# EAGLE schematic TSOC_NEOLED_R0_2 (EAGLE 6.6.0)
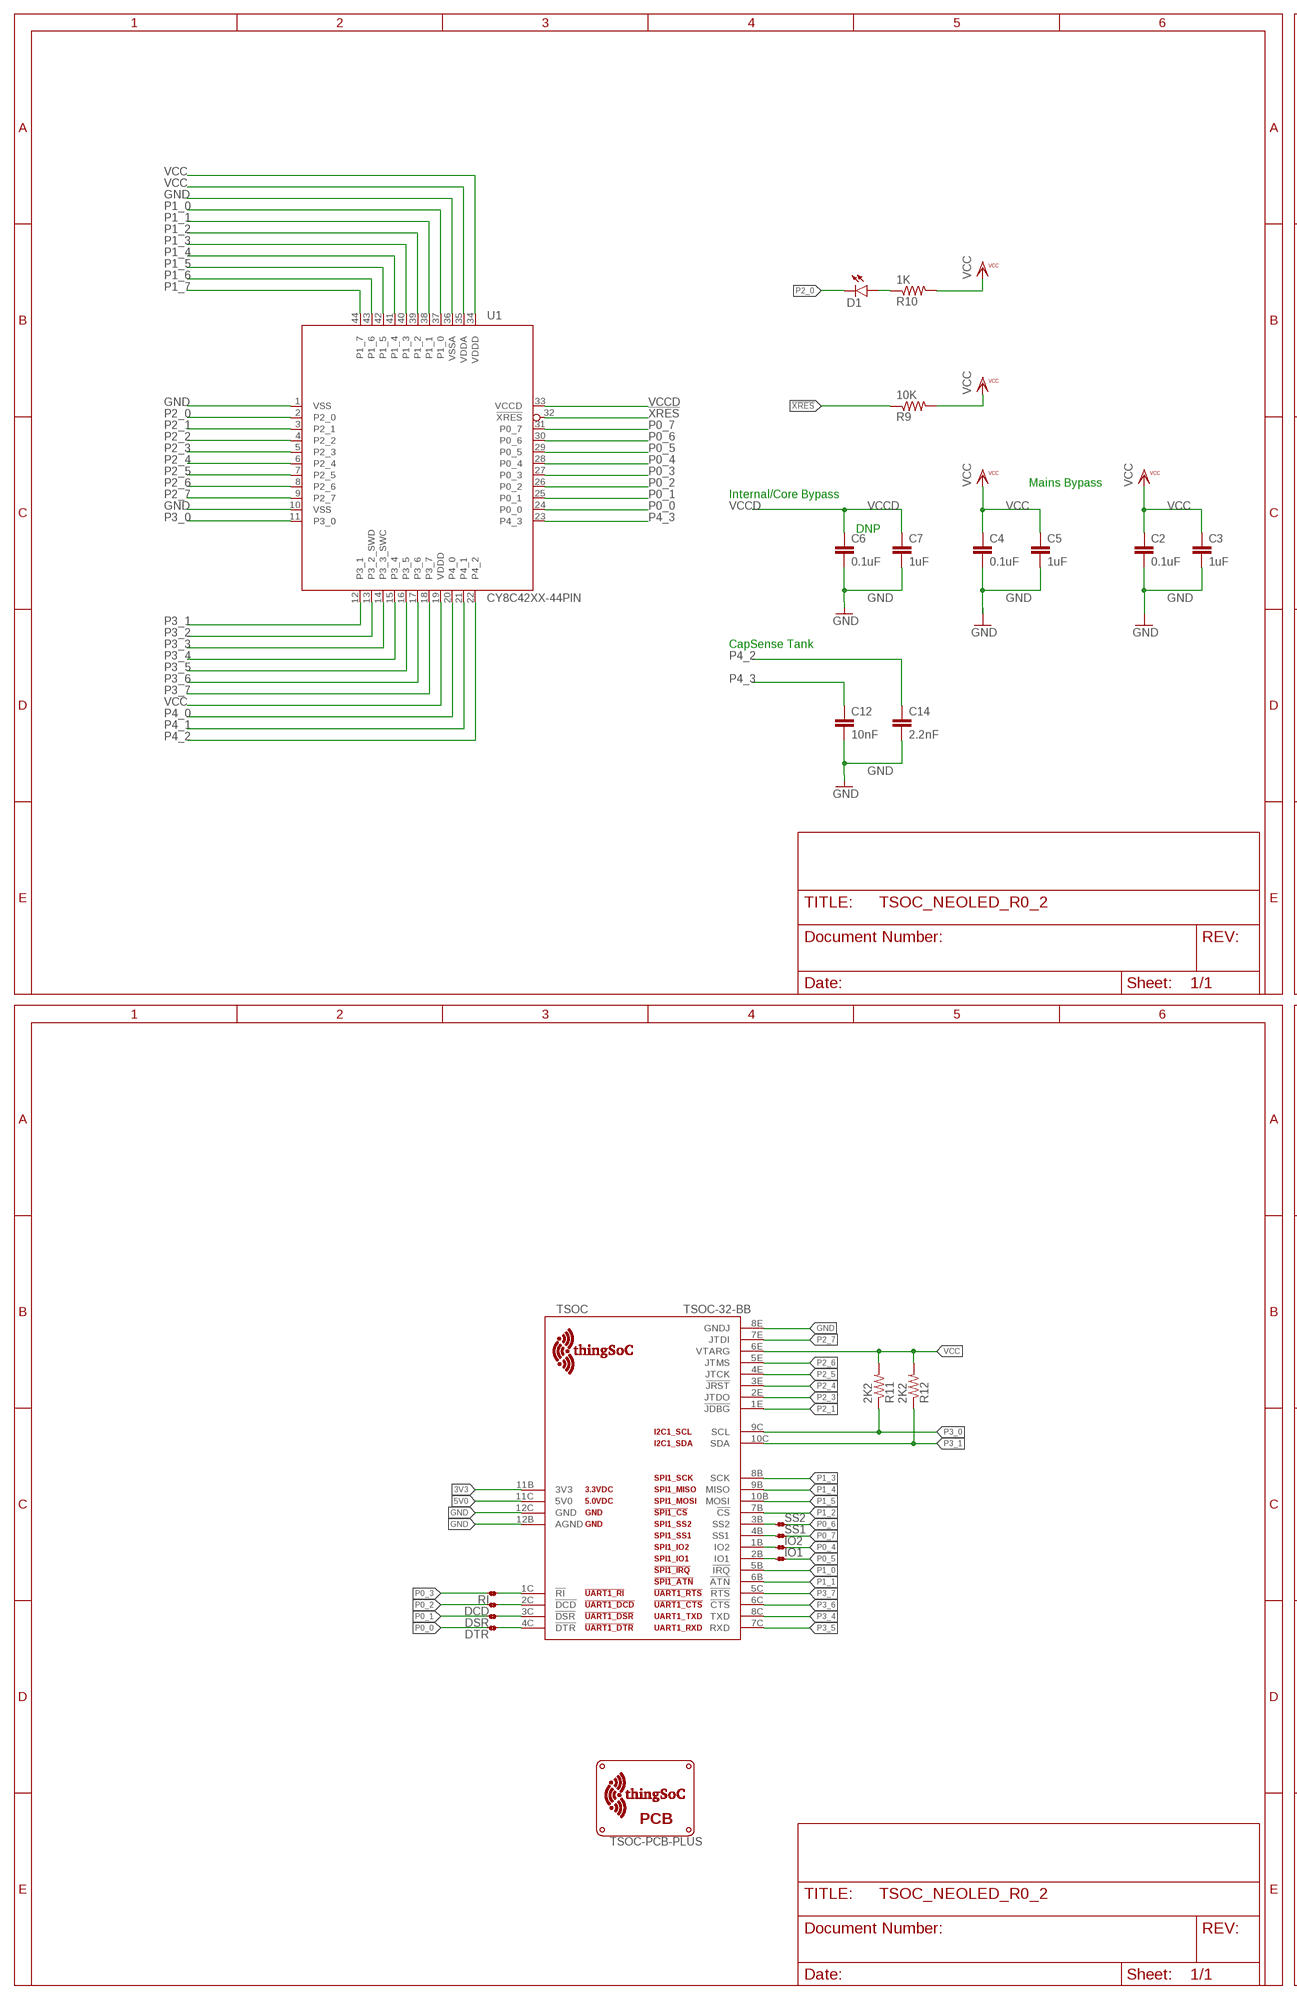
[diagram p0: schematic, sheet 1, part 1 of 2]
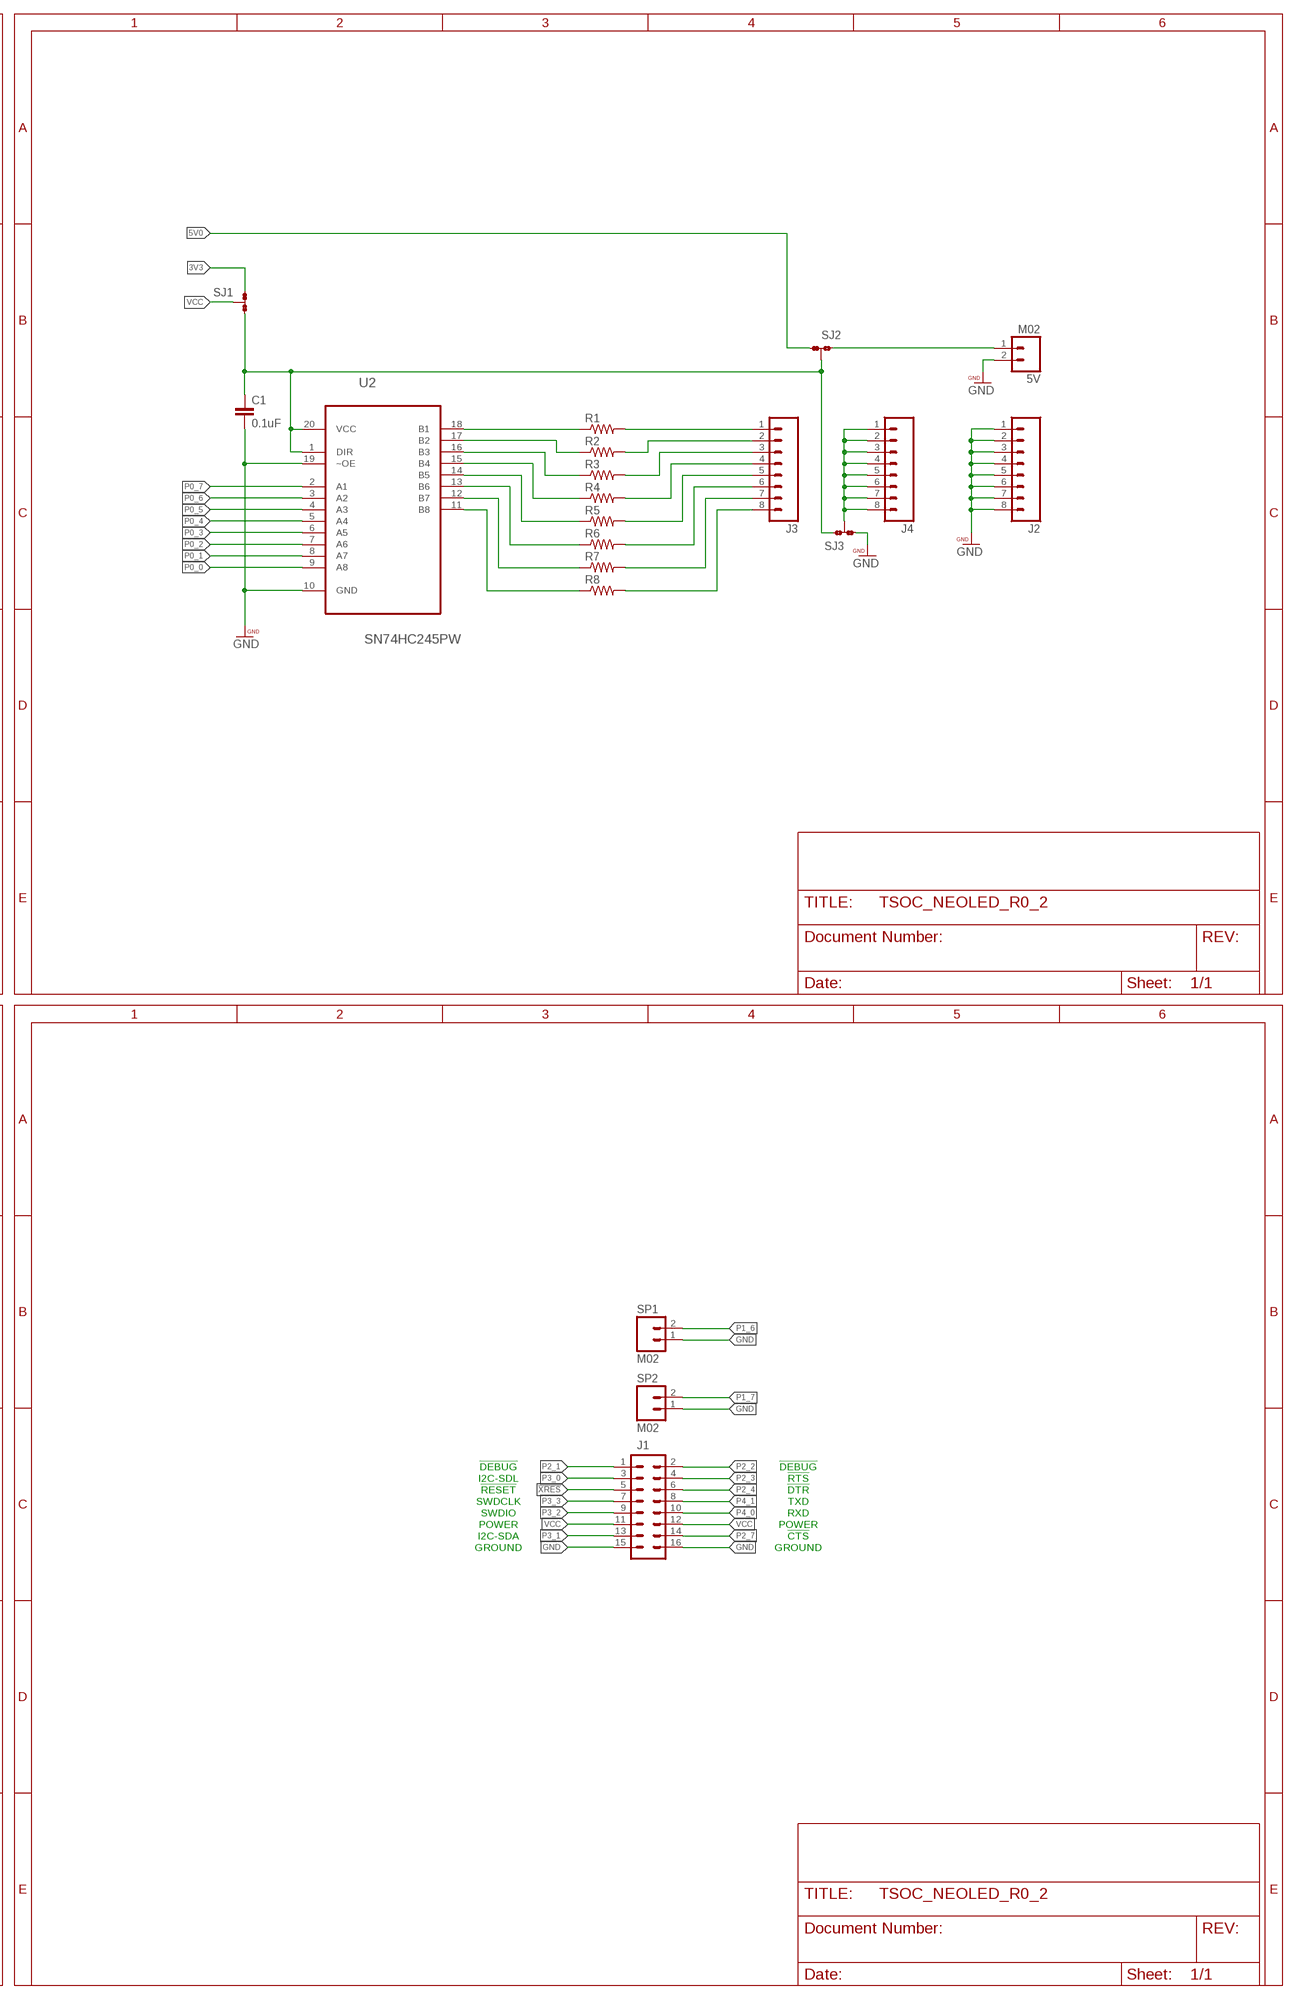
[diagram p1: schematic, sheet 1, part 2 of 2]

## Parts
5V  M02  [1X02]
C1  0.1uF  CAP0603-CAP  [0603-CAP]
C2  0.1uF  CAP0603-CAP  [0603-CAP]
C3  1uF  CAP0603-CAP  [0603-CAP]
C4  0.1uF  CAP0603-CAP  [0603-CAP]
C5  1uF  CAP0603-CAP  [0603-CAP]
C6  0.1uF  CAP0603-CAP  [0603-CAP]
C7  1uF  CAP0603-CAP  [0603-CAP]
C12  10nF  CAP0603-CAP  [0603-CAP]
C14  2.2nF  CAP0603-CAP  [0603-CAP]
D1  LED0603  [LED-0603]
DCD  JMP-2-NO  [JMP-2-NO]
DSR  JMP-2-NO  [JMP-2-NO]
DTR  JMP-2-NO  [JMP-2-NO]
IO1  JMP-2-NO  [JMP-2-NO]
IO2  JMP-2-NO  [JMP-2-NO]
J1  M08X2  [2X8]
J2  M08  [1X08_ROUND]
J3  M08  [1X08_ROUND]
J4  M08  [1X08_ROUND]
R1  RESISTOR0603-RES  [0603-RES]
R2  RESISTOR0603-RES  [0603-RES]
R3  RESISTOR0603-RES  [0603-RES]
R4  RESISTOR0603-RES  [0603-RES]
R5  RESISTOR0603-RES  [0603-RES]
R6  RESISTOR0603-RES  [0603-RES]
R7  RESISTOR0603-RES  [0603-RES]
R8  RESISTOR0603-RES  [0603-RES]
R9  10K  RESISTOR_SFE0603-RES  [0603-RES]
R10  1K  RESISTOR_SFE0603-RES  [0603-RES]
R11  2K2  RESISTOR_SFE0603-RES  [0603-RES]
R12  2K2  RESISTOR_SFE0603-RES  [0603-RES]
RI  JMP-2-NO  [JMP-2-NO]
SJ1  JMP-3-1_2  [JMP-3-1_2]
SJ2  JMP-3-1_2  [JMP-3-1_2]
SJ3  JMP-3-1_2  [JMP-3-1_2]
SP1  M02  [1X02]
SP2  M02  [1X02]
SS1  JMP-2-NO  [JMP-2-NO]
SS2  JMP-2-NO  [JMP-2-NO]
TSOC  TSOC-32-BB  [TSOC-BB-S32]
U1  CY8C42XX-44PIN  [TQFP-10X10-44]
U2  SN74HC245PW  [SOP65P640X120-20N]
U$3  TSOC-PCB-PLUS  [TSOC-BB-BRD-PLUS]

## Nets
3V3: SJ1.1 TSOC.11B(3V3)
5V0: SJ2.1 TSOC.11C(5V0)
!DCD: DCD.1 TSOC.2C(!DCD)
!DSR: DSR.1 TSOC.3C(!DSR)
!DTR: DTR.1 TSOC.4C(!DTR)
!R!: RI.1 TSOC.1C(!RI)
!XRES: J1.5 R9.1 U1.32(!XRES)
GND: 5V.2 C1.2 C2.2 C3.2 C4.2 C5.2 C6.2 C7.2 C12.2 C14.2 J1.15 J1.16 J2.1 J2.2 J2.3 J2.4 J2.5 J2.6 J2.7 J2.8 SJ3.1 SP1.1 SP2.1 TSOC.8E(GNDJ) TSOC.12B(AGND) TSOC.12C(GND) U1.1(VSS) U1.10(VSS) U1.36(VSSA) U2.10(GND) U2.19(~OE)
IO1: IO1.1 TSOC.2B(IO1)
IO2: IO2.1 TSOC.1B(IO2)
N$1: J3.1 R1.2
N$2: J3.2 R2.2
N$3: J3.3 R3.2
N$4: J3.4 R4.2
N$5: J3.5 R5.2
N$6: J3.6 R6.2
N$7: J3.7 R7.2
N$8: J3.8 R8.2
N$9: R1.1 U2.18(B1)
N$10: R2.1 U2.17(B2)
N$11: R3.1 U2.16(B3)
N$12: R4.1 U2.15(B4)
N$13: R5.1 U2.14(B5)
N$14: R6.1 U2.13(B6)
N$15: R7.1 U2.12(B7)
N$16: R8.1 U2.11(B8)
N$17: D1.A R10.1
P0_0: DTR.2 U1.24(P0_0) U2.9(A8)
P0_1: DSR.2 U1.25(P0_1) U2.8(A7)
P0_2: DCD.2 U1.26(P0_2) U2.7(A6)
P0_3: RI.2 U1.27(P0_3) U2.6(A5)
P0_4: IO2.2 U1.28(P0_4) U2.5(A4)
P0_5: IO1.2 U1.29(P0_5) U2.4(A3)
P0_6: SS2.2 U1.30(P0_6) U2.3(A2)
P0_7: SS1.2 U1.31(P0_7) U2.2(A1)
P1_0: TSOC.5B(!IRQ) U1.37(P1_0)
P1_1: TSOC.6B(!ATN) U1.38(P1_1)
P1_2: TSOC.7B(!CS) U1.39(P1_2)
P1_3: TSOC.8B(SCK) U1.40(P1_3)
P1_4: TSOC.9B(MISO) U1.41(P1_4)
P1_5: TSOC.10B(MOSI) U1.42(P1_5)
P1_6: SP1.2 U1.43(P1_6)
P1_7: SP2.2 U1.44(P1_7)
P2_0: D1.C U1.2(P2_0)
P2_1: J1.1 TSOC.1E(!JDBG) U1.3(P2_1)
P2_2: J1.2 U1.4(P2_2)
P2_3: J1.4 TSOC.2E(JTDO) U1.5(P2_3)
P2_4: J1.6 TSOC.3E(!JRST) U1.6(P2_4)
P2_5: TSOC.4E(JTCK) U1.7(P2_5)
P2_6: TSOC.5E(JTMS) U1.8(P2_6)
P2_7: J1.14 TSOC.7E(JTDI) U1.9(P2_7)
P3_0: J1.3 R11.1 TSOC.9C(SCL) U1.11(P3_0)
P3_1: J1.13 R12.1 TSOC.10C(SDA) U1.12(P3_1)
P3_2: J1.9 U1.13(P3_2_SWD)
P3_3: J1.7 U1.14(P3_3_SWC)
P3_4: TSOC.8C(TXD) U1.15(P3_4)
P3_5: TSOC.7C(RXD) U1.16(P3_5)
P3_6: TSOC.6C(!CTS) U1.17(P3_6)
P3_7: TSOC.5C(!RTS) U1.18(P3_7)
P4_0: J1.10 U1.20(P4_0)
P4_1: J1.8 U1.21(P4_1)
P4_2: C14.1 U1.22(P4_2)
P4_3: C12.1 U1.23(P4_3)
SS1: SS1.1 TSOC.4B(SS1)
SS2: SS2.1 TSOC.3B(SS2)
VCC: C2.1 C3.1 C4.1 C5.1 J1.11 J1.12 R9.2 R10.2 R11.2 R12.2 SJ1.2 TSOC.6E(VTARG) U1.19(VDDD) U1.34(VDDD) U1.35(VDDA)
VCCD: C6.1 C7.1 U1.33(VCCD)
VEXT: 5V.1 SJ2.3
VIN: C1.1 SJ1.3 SJ2.2 SJ3.3 U2.1(DIR) U2.20(VCC)
VOUT: J4.1 J4.2 J4.3 J4.4 J4.5 J4.6 J4.7 J4.8 SJ3.2

## Notes on the sheet
- Mains Bypass
- Internal/Core Bypass
- DNP
- CapSense Tank
- !DEBUG | !DEBUG
- I2C-SDL | !RTS
- !RESET | !DTR
- SWDCLK | TXD
- SWDIO | RXD
- POWER | POWER
- I2C-SDA | !CTS
- GROUND | GROUND

## Library data of the parts
5V SP1 SP2 = PatternAgents-ProtoPads:M02
C1-C7 C12 C14 = PatternAgents-Misc:CAP: Capacitor Standard 0603 ceramic capacitor, and 0.1" leaded capacitor.
D1 = TSOC-ESP8266-BASE:LED: LEDs Standard schematic elements and footprints for 5mm, 3mm, 1206, and 0603 sized LEDs. 5mm - Spark Fun Electronics SKU : COM-00529 (and others)
DCD DSR DTR IO1 IO2 RI SS1 SS2 = PatternAgents-ProtoPads:JMP-2-NO: Two Terminal Jumper - Normally Open Positions 1 and 2 are normally NOT connected. PatternAgents ProtoPads Library Schematic and PCB layout libraries for design patterns by PatternAgents. For the CADSoft Eagle CAD program : http://www.cadsoftusa.com/download-eagle/ Source LBR : http://www.patternagents.com Github : https://github.com/PatternAgents License : http://creativecommons.org/licenses/by-sa/4.0/ (Creative Commons 4.0) THIS SOFTWARE IS PROVIDED BY THE CONTRIBUTORS "AS IS" AND WITHOUT ANY EXPRESS OR IMPLIED WARRANTIES, INCLUDING, BUT NOT LIMITED TO, THE IMPLIED WARRANTIES OF MERCHANTABILITY AND FITNESS FOR A PARTICULAR PURPOSE ARE DISCLAIMED. IN NO EVENT SHALL THE COPYRIGHT OWNER OR CONTRIBUTORS BE LIABLE FOR ANY DIRECT, INDIRECT, INCIDENTAL, SPECIAL, EXEMPLARY, OR CONSEQUENTIAL DAMAGES (INCLUDING, BUT NOT LIMITED TO, PROCUREMENT OF SUBSTITUTE GOODS OR SERVICES; LOSS OF USE, DATA, OR PROFITS; OR BUSINESS INTERRUPTION) HOWEVER CAUSED AND ON ANY THEORY OF LIABILITY, WHETHER IN CONTRACT, STRICT LIABILITY, OR TORT (INCLUDING NEGLIGENCE OR OTHERWISE) ARISING IN ANY WAY OUT OF THE USE OF THIS SOFTWARE, EVEN IF ADVISED OF THE POSSIBILITY OF SUCH DAMAGE.; BOM: EXCLUDE
J1 = PatternAgents-ProtoPads:M08X2: .1" headers, two rows of 8 each
J2-J4 = PatternAgents-ProtoPads:M08: Header 8 Standard 8-pin 0.1" header
R1-R8 = PatternAgents-ProtoPads:RESISTOR: Resistor Basic schematic elements and footprints for 0603, 1206, and PTH resistors.
R9-R12 = PatternAgents-Misc:RESISTOR_SFE: Resistor Basic schematic elements and footprints for 0603, 1206, and PTH resistors.
SJ1-SJ3 = PatternAgents-ProtoPads:JMP-3-1_2: Three Terminal Jumper - 1 & 2 Connected Positions 1and 2 are normally connected. PatternAgents ProtoPads Library Schematic and PCB layout libraries for design patterns by PatternAgents. For the CADSoft Eagle CAD program : http://www.cadsoftusa.com/download-eagle/ Source LBR : http://www.patternagents.com Github : https://github.com/PatternAgents License : http://creativecommons.org/licenses/by-sa/4.0/ (Creative Commons 4.0) THIS SOFTWARE IS PROVIDED BY THE CONTRIBUTORS "AS IS" AND WITHOUT ANY EXPRESS OR IMPLIED WARRANTIES, INCLUDING, BUT NOT LIMITED TO, THE IMPLIED WARRANTIES OF MERCHANTABILITY AND FITNESS FOR A PARTICULAR PURPOSE ARE DISCLAIMED. IN NO EVENT SHALL THE COPYRIGHT OWNER OR CONTRIBUTORS BE LIABLE FOR ANY DIRECT, INDIRECT, INCIDENTAL, SPECIAL, EXEMPLARY, OR CONSEQUENTIAL DAMAGES (INCLUDING, BUT NOT LIMITED TO, PROCUREMENT OF SUBSTITUTE GOODS OR SERVICES; LOSS OF USE, DATA, OR PROFITS; OR BUSINESS INTERRUPTION) HOWEVER CAUSED AND ON ANY THEORY OF LIABILITY, WHETHER IN CONTRACT, STRICT LIABILITY, OR TORT (INCLUDING NEGLIGENCE OR OTHERWISE) ARISING IN ANY WAY OUT OF THE USE OF THIS SOFTWARE, EVEN IF ADVISED OF THE POSSIBILITY OF SUCH DAMAGE.; BOM: EXCLUDE
TSOC = thingSoC:TSOC-32: thingSoC Thirty-Two (32) Pin Socket Source LBR : http://www.thingsoc.com Github : https://github.com/thingsoc License : http://creativecommons.org/licenses/by-sa/4.0/ (Creative Commons 4.0) THIS SOFTWARE IS PROVIDED BY THE CONTRIBUTORS "AS IS" AND WITHOUT ANY EXPRESS OR IMPLIED WARRANTIES, INCLUDING, BUT NOT LIMITED TO, THE IMPLIED WARRANTIES OF MERCHANTABILITY AND FITNESS FOR A PARTICULAR PURPOSE ARE DISCLAIMED. IN NO EVENT SHALL THE COPYRIGHT OWNER OR CONTRIBUTORS BE LIABLE FOR ANY DIRECT, INDIRECT, INCIDENTAL, SPECIAL, EXEMPLARY, OR CONSEQUENTIAL DAMAGES (INCLUDING, BUT NOT LIMITED TO, PROCUREMENT OF SUBSTITUTE GOODS OR SERVICES; LOSS OF USE, DATA, OR PROFITS; OR BUSINESS INTERRUPTION) HOWEVER CAUSED AND ON ANY THEORY OF LIABILITY, WHETHER IN CONTRACT, STRICT LIABILITY, OR TORT (INCLUDING NEGLIGENCE OR OTHERWISE) ARISING IN ANY WAY OUT OF THE USE OF THIS SOFTWARE, EVEN IF ADVISED OF THE POSSIBILITY OF SUCH DAMAGE.
U1 = PatternAgents-Cypress:CY8C42XX-44PIN: Cypress PSoC® 4 - Programmable System on Chip, Cortex-M0 Based http://www.cypress.com/?mpn=CY8C4245AXI-483 LBR Source: http://www.patternagents.com THIS SOFTWARE IS PROVIDED BY THE CONTRIBUTORS "AS IS" AND WITHOUT ANY EXPRESS OR IMPLIED WARRANTIES, INCLUDING, BUT NOT LIMITED TO, THE IMPLIED WARRANTIES OF MERCHANTABILITY AND FITNESS FOR A PARTICULAR PURPOSE ARE DISCLAIMED. IN NO EVENT SHALL THE COPYRIGHT OWNER OR CONTRIBUTORS BE LIABLE FOR ANY DIRECT, INDIRECT, INCIDENTAL, SPECIAL, EXEMPLARY, OR CONSEQUENTIAL DAMAGES (INCLUDING, BUT NOT LIMITED TO, PROCUREMENT OF SUBSTITUTE GOODS OR SERVICES; LOSS OF USE, DATA, OR PROFITS; OR BUSINESS INTERRUPTION) HOWEVER CAUSED AND ON ANY THEORY OF LIABILITY, WHETHER IN CONTRACT, STRICT LIABILITY, OR TORT (INCLUDING NEGLIGENCE OR OTHERWISE) ARISING IN ANY WAY OUT OF THE USE OF THIS SOFTWARE, EVEN IF ADVISED OF THE POSSIBILITY OF SUCH DAMAGE.
U2 = PatternAgents-TI:SN74HC245PW: OCTAL BUS TRANSCEIVERS; MPN: SN74HC245PW; OC_FARNELL: 1236221; OC_NEWARK: 13M5213; PACKAGE: TSSOP-20; SUPPLIER: Texas Instruments
U$3 = thingSoC:TSOC-PCB: thingSoC PCB Outlines Boards Outlines for Standard Sizes (in the DImension Layer) (Registration marks in the tDocu layer - make sure to turn on tDocu/bDocu) Source LBR : http://www.thingsoc.com Github : https://github.com/thingsoc License : http://creativecommons.org/licenses/by-sa/4.0/ (Creative Commons 4.0) THIS SOFTWARE IS PROVIDED BY THE CONTRIBUTORS "AS IS" AND WITHOUT ANY EXPRESS OR IMPLIED WARRANTIES, INCLUDING, BUT NOT LIMITED TO, THE IMPLIED WARRANTIES OF MERCHANTABILITY AND FITNESS FOR A PARTICULAR PURPOSE ARE DISCLAIMED. IN NO EVENT SHALL THE COPYRIGHT OWNER OR CONTRIBUTORS BE LIABLE FOR ANY DIRECT, INDIRECT, INCIDENTAL, SPECIAL, EXEMPLARY, OR CONSEQUENTIAL DAMAGES (INCLUDING, BUT NOT LIMITED TO, PROCUREMENT OF SUBSTITUTE GOODS OR SERVICES; LOSS OF USE, DATA, OR PROFITS; OR BUSINESS INTERRUPTION) HOWEVER CAUSED AND ON ANY THEORY OF LIABILITY, WHETHER IN CONTRACT, STRICT LIABILITY, OR TORT (INCLUDING NEGLIGENCE OR OTHERWISE) ARISING IN ANY WAY OUT OF THE USE OF THIS SOFTWARE, EVEN IF ADVISED OF THE POSSIBILITY OF SUCH DAMAGE.